# EAGLE design 24V_to_5V_1A_switching_regulator (EAGLE 8.5.0)
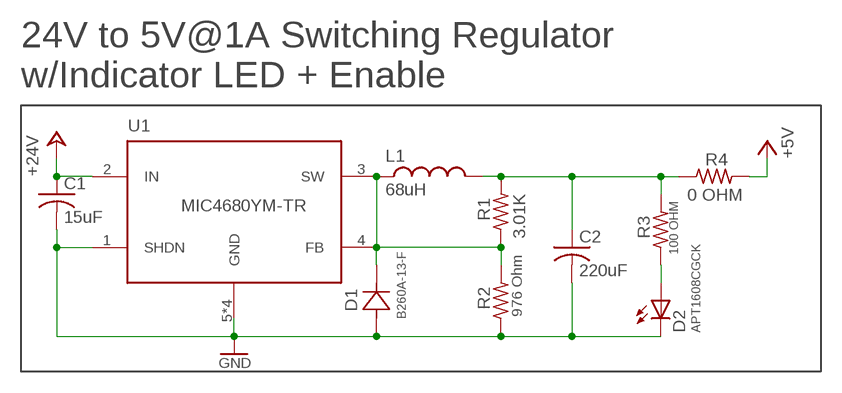
[diagram p0: schematic, sheet 1]

## Parts
C1  15uF  15UF-TPSD156K035R0100  [CT7343]
C2  220uF  220UF-TPSY227K010R0100  [CT7343]
D1  B260A-13-F  [SMA]
D2  APT1608CGCK  [CHIPLED_0603]
L1  68uH  68UH-UP2B-680-R  [UP2B]
R1  3.01K  3.01K-RC0603FR-073K01L  [RC0603N]
R2  976 Ohm  982OHM-RC0603FR-07976RL  [RC0603N]
R3  100 OHM  100OHM-RC0603JR-07100RL  [RC0603N]
R4  0 OHM  0OHM-RC0603JR-070RL  [RC0603N]
U1  MIC4680YM-TR  [SOIC8]

## Nets
+5V: R4.2
+24V: C1.+(1(+)) U1.2(IN)
GND: C1.-(2(-)) C2.-(2(-)) D1.2 D2.C R2.1 U1.1(SHDN) U1.5(GND) U1.6(GND) U1.7(GND) U1.8(GND)
N$5: D2.A R3.1
N$6: C2.+(1(+)) L1.2 R1.2 R3.2 R4.1
N$7: D1.1 L1.1 R1.1 R2.2 U1.3(SW) U1.4(FB)

## Notes on the sheet
- 24V to 5V@1A Switching Regulator
  w/Indicator LED + Enable

## Library data of the parts
C1 = openag-capacitors:15UF-TPSD156K035R0100: AVX Corporation - TPSD156K035R0100 - CAP TANT 15UF 35V 10% 2917 Description: 15µF Molded Tantalum Capacitors 35V 2917 (7343 Metric) 100 mOhm Technical Specifications: Capacitance: 15µF Tolerance: ±10% Voltage - Rated: 35V Type: Molded ESR (Equivalent Series Resistance): 100 mOhm Operating Temperature: -55°C ~ 125°C Mounting Type: Surface Mount Package / Case: 2917 (7343 Metric) Size / Dimension: 0.287" L x 0.169" W (7.30mm x 4.30mm) Height - Seated (Max): 0.122" (3.10mm) Manufacturer Size Code: D Features: General Purpose Datasheet(s): TPS Series, Low ESR <http://datasheets.avx.com/TPS.pdf> Vendor(s): Digikey: 478-4100-1-ND <https://www.digikey.com/scripts/DkSearch/dksus.dll?Detail&itemSeq=250948407&uq=636531796868727362#>
C2 = openag-capacitors:220UF-TPSY227K010R0100: AVX Corporation - TPSY227K010R0100 - CAP TANT 220UF 10V 10% 2917 Description: 220µF Molded Tantalum Capacitors 10V 2917 (7343 Metric) 100 mOhm Technical Specifications: Capacitance: 220µF Tolerance: ±10% Voltage - Rated: 10V Type: Molded ESR (Equivalent Series Resistance): 100 mOhm Operating Temperature: -55°C ~ 125°C Mounting Type: Surface Mount Package / Case: 2917 (7343 Metric) Size / Dimension: 0.287" L x 0.169" W (7.30mm x 4.30mm) Height - Seated (Max): 0.079" (2.00mm) Manufacturer Size Code: Y Features: General Purpose Datasheet(s): TPS Series, Low ESR <http://datasheets.avx.com/TPS.pdf> Vendor(s): Digikey: 478-5408-1-ND <https://www.digikey.com/scripts/DkSearch/dksus.dll?Detail&itemSeq=250948888&uq=636531796868737363>
D1 = openag-diodes:B260A-13-F: Diodes Incorporated - B260A-13-F - DIODE SCHOTTKY 60V 2A SMA Description: Diode Schottky 60V 2A Surface Mount SMA Technical Specifications: Diode Type: Schottky Voltage - DC Reverse (Vr) (Max): 60V Current - Average Rectified (Io): 2A Voltage - Forward (Vf) (Max) @ If: 700mV @ 2A Speed: Fast Recovery =< 500ns, > 200mA (Io) Current - Reverse Leakage @ Vr: 500µA @ 60V Capacitance @ Vr, F: 200pF @ 4V, 1MHz Mounting Type: Surface Mount Package / Case: DO-214AC, SMA Supplier Device Package: SMA Operating Temperature - Junction: -65°C ~ 150°C Base Part Number: B260 Datasheet(s): B220(A) - B260(A) <https://www.diodes.com/assets/Datasheets/ds13004.pdf> Vendor(s): Digikey: B260A-FDICT-ND <https://www.digikey.com/product-detail/en/B260A-13-F/B260A-FDICT-ND/755494>
D2 = openag-diodes:APT1608CGCK: Kingbright - APT1608CGCK - LED GREEN CLEAR 0603 SMD Description: Green 570nm LED Indication - Discrete 2.1V 0603 (1608 Metric) Technical Specifications: Color: Green Lens Color: Colorless Lens Transparency: Clear Millicandela Rating: 50mcd Lens Style/Size: Rectangle with Flat Top, 1.20mm x 0.80mm Voltage - Forward (Vf) (Typ): 2.1V Current - Test: 20mA Viewing Angle: 120° Mounting Type: Surface Mount Wavelength - Dominant: 570nm Wavelength - Peak: 574nm Package / Case: 0603 (1608 Metric) Supplier Device Package: Chip LED Size / Dimension: 1.60mm L x 0.80mm W Height (Max): 0.75mm Datasheet(s): APT1608CGCK <http://www.kingbrightusa.com/images/catalog/SPEC/APT1608CGCK.pdf> Vendor(s): Digikey: 754-1116-1-ND <https://www.digikey.com/product-detail/en/kingbright/APT1608CGCK/754-1116-1-ND/1747833#>; POPULATE: YES; VERIFIED: NO
L1 = openag-inductors:68UH-UP2B-680-R: Eaton - UP2B-680-R - FIXED IND 68UH 1.5A 178.7 MOHM Description: 68µH Unshielded Wirewound Inductor 1.5A 178.7 mOhm Max Nonstandard Technical Specifications: Type: Wirewound Material - Core: Ferrite Inductance: 68µH Tolerance: ±20% Current Rating: 1.5A Current - Saturation: 1.2A Shielding: Unshielded DC Resistance (DCR): 178.7 mOhm Max Operating Temperature: -40°C ~ 85°C Frequency - Test: 100kHz Mounting Type: Surface Mount Package / Case: Nonstandard Size / Dimension: 0.550" L x 0.410" W (13.97mm x 10.41mm) Height - Seated (Max): 0.236" (6.00mm) Datasheet(s): UNI-PAC (-R) <http://www.cooperindustries.com/content/dam/public/bussmann/Electronics/Resources/product-datasheets/BUS_Elx_PM_4308_UNI_PAC_Power_Inductors.pdf> Vendor(s): Digikey: 513-1083-1-ND <https://www.digikey.com/scripts/DkSearch/dksus.dll?Detail&itemSeq=250945518&uq=636531821133403587>
R1 = openag-resistors:3.01K-RC0603FR-073K01L: Yageo - RC0603FR-073K01L - RES SMD 3.01K OHM 1% 1/10W 0603 Description: 3.01 kOhms ±1% 0.1W, 1/10W Chip Resistor 0603 (1608 Metric) Moisture Resistant Thick Film Technical Specifications: Resistance: 3.01 kOhms Tolerance: ±1% Power (Watts): 0.1W, 1/10W Composition: Thick Film Features: Moisture Resistant Temperature Coefficient: ±100ppm/°C Operating Temperature: -55°C ~ 155°C Package / Case: 0603 (1608 Metric) Supplier Device Package: 0603 Size / Dimension: 0.063" L x 0.032" W (1.60mm x 0.80mm) Height - Seated (Max): 0.022" (0.55mm) Number of Terminations: 2 Datasheet(s): Chip Resistor Marking <http://www.yageo.com/exep/pages/download/literatures/PYu-R_Marking_2.pdf> RC Series, L Datasheet <http://www.yageo.com/documents/recent/PYu-RC_Group_51_RoHS_L_8.pdf> Vendor(s): Digikey: 311-3.01KHRCT-ND <https://www.digikey.com/scripts/DkSearch/dksus.dll?Detail&itemSeq=250949714&uq=636531832410541188>
R2 = openag-resistors:982OHM-RC0603FR-07976RL: Yageo - RC0603FR-07976RL - RES SMD 976 OHM 1% 1/10W 0603 Description: 976 Ohms ±1% 0.1W, 1/10W Chip Resistor 0603 (1608 Metric) Moisture Resistant Thick Film Technical Specifications: Resistance: 976 Ohms Tolerance: ±1% Power (Watts): 0.1W, 1/10W Composition: Thick Film Features: Moisture Resistant Temperature Coefficient: ±100ppm/°C Operating Temperature: -55°C ~ 155°C Package / Case: 0603 (1608 Metric) Supplier Device Package: 0603 Size / Dimension: 0.063" L x 0.032" W (1.60mm x 0.80mm) Height - Seated (Max): 0.022" (0.55mm) Number of Terminations: 2 Datasheet(s): Chip Resistor Marking <http://www.yageo.com/exep/pages/download/literatures/PYu-R_Marking_2.pdf> RC Series, L Datasheet <http://www.yageo.com/documents/recent/PYu-RC_Group_51_RoHS_L_8.pdf> Vendor(s): Digikey: 311-976HRCT-ND <https://www.digikey.com/scripts/DkSearch/dksus.dll?Detail&itemSeq=250949870&uq=636531835229553061>
R3 = openag-resistors:100OHM-RC0603JR-07100RL: Yageo - RC0603JR-07100RL - RES SMD 100 OHM 5% 1/10W 0603 Description: 100 Ohms ±5% 0.1W, 1/10W Chip Resistor 0603 (1608 Metric) Moisture Resistant Thick Film Technical Specifications: Resistance: 100 Ohms Tolerance: ±5% Power (Watts): 0.1W, 1/10W Composition: Thick Film Features: Moisture Resistant Temperature Coefficient: ±100ppm/°C Operating Temperature: -55°C ~ 155°C Package / Case: 0603 (1608 Metric) Supplier Device Package: 0603 Size / Dimension: 0.063" L x 0.032" W (1.60mm x 0.80mm) Height - Seated (Max): 0.022" (0.55mm) Number of Terminations: 2 Datasheet(s): Thick Film Chip Resistor Intro <http://www.yageo.com.tw/exep/pages/download/literatures/PYu-R_INT-thick_7.pdf> Chip Resistor Marking <http://www.yageo.com/exep/pages/download/literatures/PYu-R_Marking_2.pdf> RC Series, L Datasheet <http://www.yageo.com/documents/recent/PYu-RC_Group_51_RoHS_L_8.pdf> Vendor(s): Digikey: 311-100GRCT-ND <https://www.digikey.com/product-detail/en/yageo/RC0603JR-07100RL/311-100GRCT-ND/729644>; POPULATE: YES; VERIFIED: NO
R4 = openag-resistors:0OHM-RC0603JR-070RL: Yageo - RC0603JR-070RL - RES SMD 0 OHM JUMPER 1/10W 0603 Description: 0 Ohms Jumper 0.1W, 1/10W Chip Resistor 0603 (1608 Metric) Moisture Resistant Thick Film Technical Specifications: Resistance: 0 Ohms Power: 0.1W, 1/10W Operating Temperature: -55°C ~ 155°C Package / Case: 0603 (1608 Metric) Datasheet(s): RC Series, L Datasheet <http://www.yageo.com/documents/recent/PYu-RC_Group_51_RoHS_L_8.pdf> Vendor(s): Digikey: 311-0.0GRCT-ND <https://www.digikey.com/product-detail/en/yageo/RC0603JR-070RL/311-0.0GRCT-ND/729622>; POPULATE: YES; VERIFIED: NO
U1 = openag-regulators:MIC4680YM-TR: Microchip Technology - MIC4680YM-TR - IC REG BUCK BOOST ADJ 1.3A 8SOIC Description: Buck, Buck-Boost Switching Regulator IC Positive Adjustable 1.23V 1 Output 1.3A 8-SOIC (0.154", 3.90mm Width) Technical Specifications: Function: Step-Down, Step-Up/Step-Down Output Configuration: Positive Topology: Buck, Buck-Boost Output Type: Adjustable Number of Outputs: 1 Voltage - Input (Min): 4V Voltage - Input (Max): 34V Voltage - Output (Min/Fixed): 1.23V Voltage - Output (Max): 32.98V Current - Output: 1.3A Frequency - Switching: 200kHz Synchronous Rectifier: No Operating Temperature: -40°C ~ 125°C (TJ) Mounting Type: Surface Mount Package / Case: 8-SOIC (0.154", 3.90mm Width) Supplier Device Package: 8-SOIC Base Part Number: MIC4680 Datasheet(s): MIC4680 <http://www.microchip.com/mymicrochip/filehandler.aspx?ddocname=en579250> Vendor(s): Digikey: 576-1222-1-ND <https://www.digikey.com/scripts/DkSearch/dksus.dll?Detail&itemSeq=250950999&uq=636531791983475304>

## Board
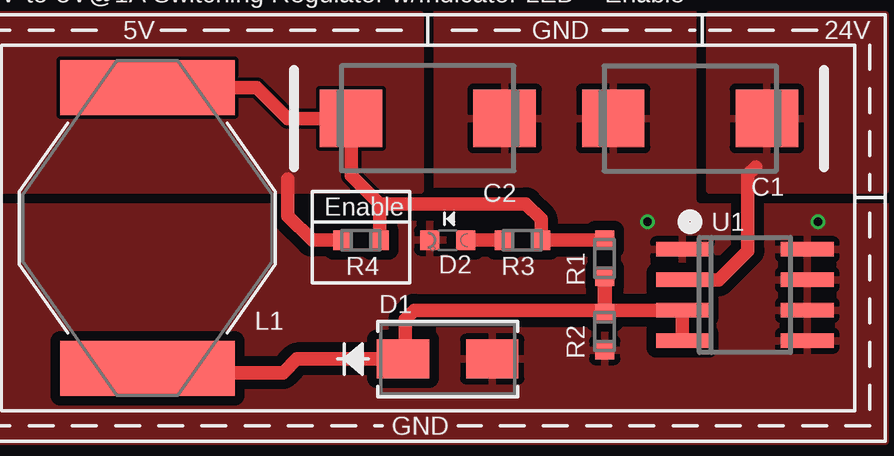
[diagram p1: board, top side]
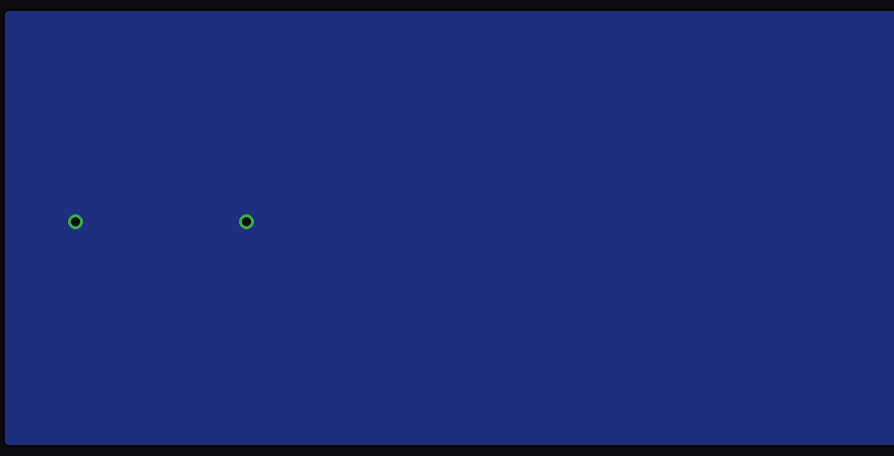
[diagram p2: board, bottom side, seen from below]

No outline drawn. Coordinates in mm, seen from the top.
Copper layers (1*16): Top 0.035559375mm / dielectric 1.6mm / Bottom 0.035559375mm
Design rules "oshpark-2layer": minimum track width 6mil, minimum drill 10mil, track to track 6mil, track to pad 6mil, pad to pad 6mil, via to via 6mil, smd to smd 6mil, copper to edge 15mil, drill to drill 6mil, minimum pad ring 5mil, minimum via ring 5mil, stop-mask expansion 2.5mil, vias tented up to drill 0mil, thermal gap 10mil

### Footprints (pad centres in the part's own frame; a part is rotated, then mirrored left to right if it is on the bottom)
CT7343 = smd 2.6 x 2.4: + -3.2,0; - 3.2,0
SMA = smd 2.18 x 1.63: 1 -1.857,0; 2 1.857,0
CHIPLED_0603 = smd 0.8 x 0.8: A 0,-0.75; C 0,0.75
UP2B = smd 2.311 x 7.29: 1 -5.855,0; 2 5.855,0
RC0603N = smd 0.756 x 0.8: 1 -0.778,0; 2 0.778,0
SOIC8 = smd 0.6 x 2.2: 1 -1.905,-2.6; 2 -0.635,-2.6; 3 0.635,-2.6; 4 1.905,-2.6; 5 1.905,2.6; 6 0.635,2.6; 7 -0.635,2.6; 8 -1.905,2.6

### Placement (x,y rotation side)
C1  29.97,13.46 180 top
C2  19.05,13.46 0 top
D1  19.88,3.43 0 top
D2  19.88,8.38 90 top
L1  7.37,8.89 90 top
R1  26.42,7.62 90 top
R2  26.42,4.57 90 top
R3  22.99,8.38 0 top
R4  16.26,8.38 180 top
U1  32.26,6.1 270 top

### Tracks (layer width: path | path; a pad name or v marks a point on that pad's centre or on a via)
+5V
  Top 0.559: R4.2 14.22,8.38 13.21,9.4 13.21,10.92
  pour Top: 0,17.78 0,10.48 18.73,10.48 18.73,17.78
+24V
  Top 0.559: U1.2 31.18,6.73 32.38,7.94 32.38,11.11 32.7,11.43
  pour Top: 38.1,17.78 30.8,17.78 30.8,10.48 38.1,10.48
GND  (via drill 0.35)
  other vias: 28.19,9.14 35.31,9.14
  pour Top (isolate 0.406, rank 2): 0,0 38.1,0 38.1,17.78 0,17.78
  pour Bottom (isolate 0.406): 0,0 38.1,0 38.1,17.78 0,17.78
N$5
  Top 0.559: R3.1 D2.A
N$6
  Top 0.559: L1.2 11.93,14.74 13.21,13.46 C2.+ 15.85,11.07 17.03,9.89 | 17.03,9.89 23.13,9.89 23.77,9.26 R3.2 23.78,8.4 R1.2 | R4.1 17.03,9.89
N$7
  Top 0.559: 26.53,5.46 U1.3 U1.4 | 26.53,5.46 R2.2 | L1.1 7.54,2.86 13.02,2.86 13.59,3.43 D1.1 18.1,3.51 18.1,5.08 18.48,5.46 26.53,5.46
  Top 0.61: R1.1 R2.2

### Text on the board
tPlace: 24V-to-5V@1A Switching Regulator w/Indicator LED + Enable | 5V | GND | 24V | Enable | GND